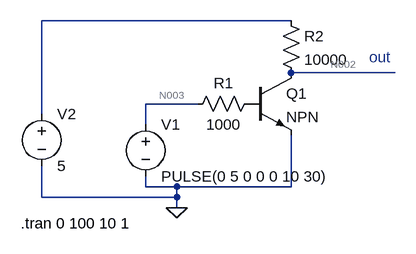
[diagram p0: schematic BipolarInverterPrateek.asc]
BipolarInverterPrateek.asc, the LTspice schematic file:
Version 4
SHEET 1 880 680
WIRE 192 -16 -192 -16
WIRE 352 64 192 64
WIRE 48 112 -32 112
WIRE -192 128 -192 -16
WIRE -32 144 -32 112
WIRE -32 240 -32 224
WIRE 16 240 -32 240
WIRE 192 240 192 160
WIRE 192 240 16 240
WIRE -192 256 -192 208
WIRE 16 256 16 240
WIRE 16 256 -192 256
WIRE 16 272 16 256
FLAG 16 272 0
SYMBOL npn 128 64 R0
SYMATTR InstName Q1
SYMBOL res 144 96 R90
WINDOW 0 0 56 VBottom 2
WINDOW 3 32 56 VTop 2
SYMATTR InstName R1
SYMATTR Value 1000
SYMATTR SpiceLine tol=1 pwr=0.1
SYMBOL res 176 -32 R0
SYMATTR InstName R2
SYMATTR Value 10000
SYMATTR SpiceLine tol=1 pwr=0.1
SYMBOL voltage -32 128 R0
WINDOW 123 0 0 Left 2
WINDOW 39 0 0 Left 2
SYMATTR InstName V1
SYMATTR Value PULSE(0 5 0 0 0 10 30)
SYMBOL voltage -192 112 R0
WINDOW 123 0 0 Left 2
WINDOW 39 0 0 Left 2
SYMATTR InstName V2
SYMATTR Value 5
TEXT 312 40 Left 2 ;out
TEXT -224 296 Left 2 !.tran 0 100 10 1

The netlist it stands for:
* BipolarInverterPrateek.asc
Q1 N002 P001 0 0 NPN
R1 P001 N003 1000 tol=1 pwr=0.1
R2 N001 N002 10000 tol=1 pwr=0.1
V1 N003 0 PULSE(0 5 0 0 0 10 30)
V2 N001 0 5
.model NPN NPN
.model PNP PNP
.lib standard.bjt
* out
.tran 0 100 10 1
.backanno
.end

* Results of the author's LTspice run, read from the files saved beside the schematic
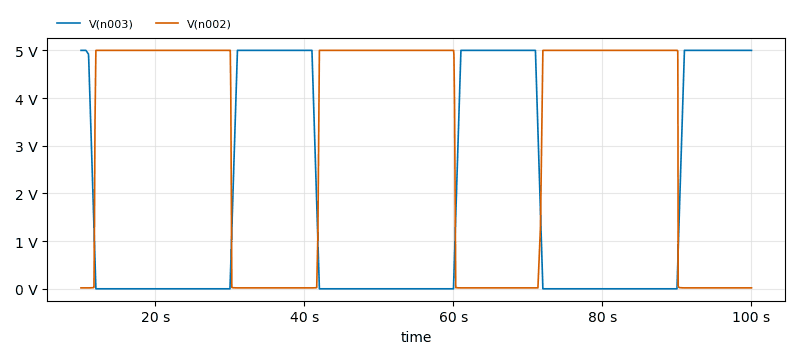
[diagram p1: Transient Analysis of BipolarInverterPrateek.asc, plotted from the saved traces]
* Transient Analysis, 1 run:
*   V(n003): min 0 V, max 5 V, average 1.833 V, rms 2.983 V, last 5 V
*   V(n002): min 19.44 mV, max 5 V, average 3.065 V, rms 3.903 V, last 19.46 mV